# EAGLE design RFID_Eval_13.56MHz (EAGLE 7.5.0)
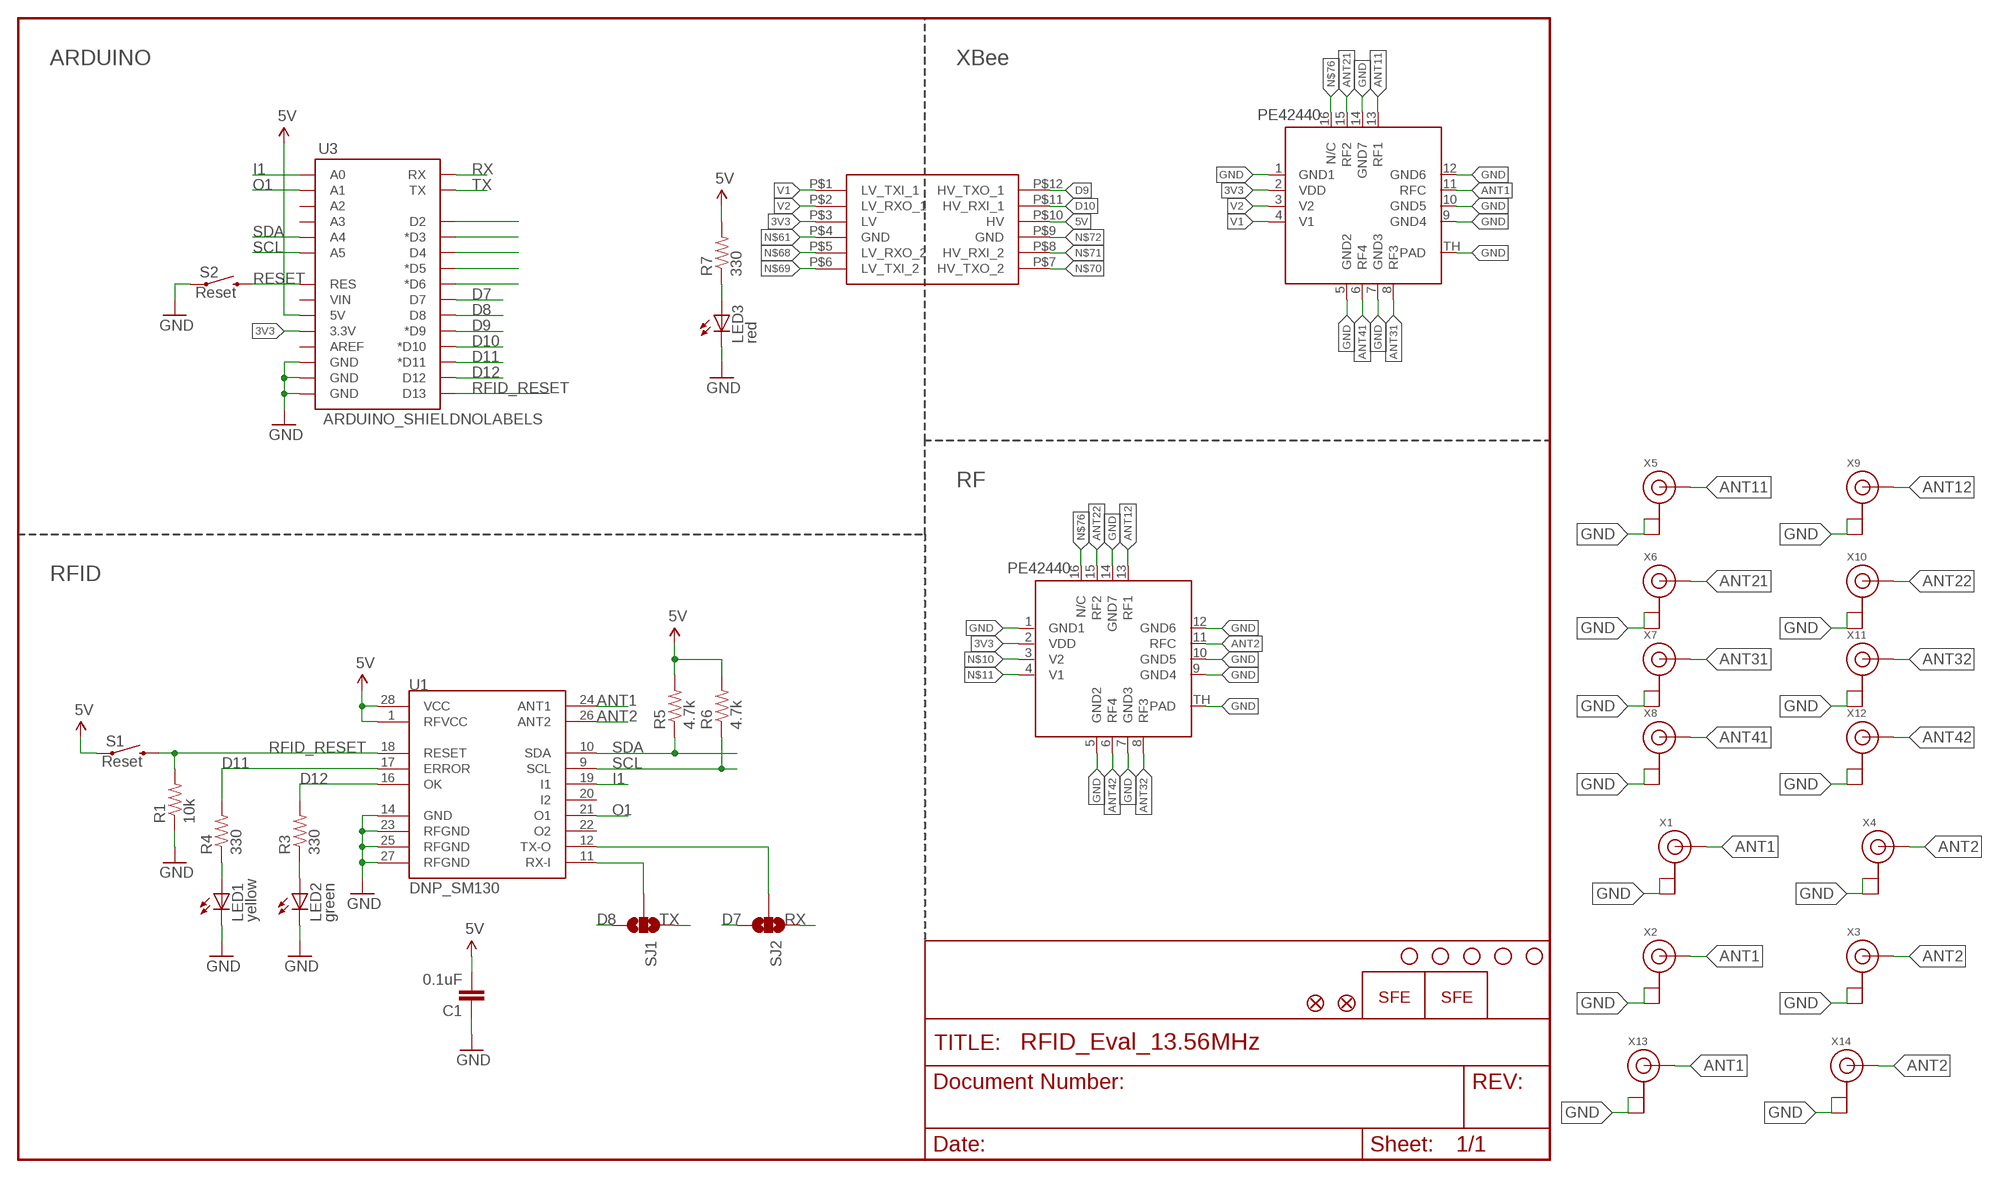
[diagram p0: schematic, sheet 1]

## Parts
C1  0.1uF  CAP0402-CAP  [0402-CAP]
JP2  LOGO-SFENEW  [SFE-NEW-WEBLOGO]
JP3  STAND-OFF  [STAND-OFF]
JP4  LOGO-SFESK  [SFE-LOGO-FLAME]
JP5  STAND-OFF  [STAND-OFF]
JP7  STAND-OFF  [STAND-OFF]
JP10  STAND-OFF  [STAND-OFF]
JP11  FIDUCIAL1X2  [FIDUCIAL-1X2]
JP12  FIDUCIAL1X2  [FIDUCIAL-1X2]
JP13  STAND-OFF  [STAND-OFF]
LED1  yellow  LED0603  [LED-0603]
LED2  green  LED0603  [LED-0603]
LED3  red  LED0603  [LED-0603]
R1  10k  RESISTOR0402-RES  [0402-RES]
R3  330  RESISTOR0402-RES  [0402-RES]
R4  330  RESISTOR0402-RES  [0402-RES]
R5  4.7k  RESISTOR0402-RES  [0402-RES]
R6  4.7k  RESISTOR0402-RES  [0402-RES]
R7  330  RESISTOR0402-RES  [0402-RES]
S1  Reset  SWITCH-MOMENTARY-2SMD  [TACTILE_SWITCH_SMD]
S2  Reset  SWITCH-MOMENTARY-2SMD  [TACTILE_SWITCH_SMD]
SJ1  SOLDERJUMPER_2WAYPASTE2&3  [SJ_3_PASTE2&3]
SJ2  SOLDERJUMPER_2WAYPASTE2&3  [SJ_3_PASTE2&3]
U1  DNP_SM130  SM130  [SM130]
U3  ARDUINO_SHIELDNOLABELS  [DUEMILANOVE_SHIELD_NOLABELS]
U$2  LOGIC_LEVEL_CONVERTER  [LOGIC_LEVEL_CONVERTER]
U$8  PE42440  [PQFP-N16]
U$9  PE42440  [PQFP-N16]
X1  ANTENNA_U.FL  [U.FL]
X2  ANTENNA_U.FL  [U.FL]
X3  ANTENNA_U.FL  [U.FL]
X4  ANTENNA_U.FL  [U.FL]
X5  ANTENNA_U.FL  [U.FL]
X6  ANTENNA_U.FL  [U.FL]
X7  ANTENNA_U.FL  [U.FL]
X8  ANTENNA_U.FL  [U.FL]
X9  ANTENNA_U.FL  [U.FL]
X10  ANTENNA_U.FL  [U.FL]
X11  ANTENNA_U.FL  [U.FL]
X12  ANTENNA_U.FL  [U.FL]
X13  ANTENNA_U.FL  [U.FL]
X14  ANTENNA_U.FL  [U.FL]

## Nets
3V3: U3.3.3V U$2.P$3(LV) U$8.2(VDD) U$9.2(VDD)
5V: C1.2 R5.2 R6.2 R7.2 S1.1 U1.1(RFVCC) U1.28(VCC) U3.5V U$2.P$10(HV)
ANT1: U1.24(ANT1) U$9.11(RFC) X1.3(SIGNAL) X2.3(SIGNAL) X13.3(SIGNAL)
ANT2: U1.26(ANT2) U$8.11(RFC) X3.3(SIGNAL) X4.3(SIGNAL) X14.3(SIGNAL)
ANT11: U$9.13(RF1) X5.3(SIGNAL)
ANT12: U$8.13(RF1) X9.3(SIGNAL)
ANT21: U$9.15(RF2) X6.3(SIGNAL)
ANT22: U$8.15(RF2) X10.3(SIGNAL)
ANT31: U$9.8(RF3) X7.3(SIGNAL)
ANT32: U$8.8(RF3) X11.3(SIGNAL)
ANT41: U$9.6(RF4) X8.3(SIGNAL)
ANT42: U$8.6(RF4) X12.3(SIGNAL)
D7: SJ2.3 U3.D7
D8: SJ1.3 U3.D8
D9: U3.D9(*D9) U$2.P$12(HV_TXO_1)
D10: U3.D10(*D10) U$2.P$11(HV_RXI_1)
D11: R4.2 U1.17(ERROR) U3.D11(*D11)
D12: R3.2 U1.16(OK) U3.D12
GND: C1.1 LED1.C LED2.C LED3.C R1.1 S2.1 U1.14(GND) U1.23(RFGND) U1.25(RFGND) U1.27(RFGND) U3.GND@0(GND) U3.GND@1(GND) U3.GND@2(GND) U$8.1(GND1) U$8.5(GND2) U$8.7(GND3) U$8.9(GND4) U$8.10(GND5) U$8.12(GND6) U$8.14(GND7) U$8.TH(PAD) U$9.1(GND1) U$9.5(GND2) U$9.7(GND3) U$9.9(GND4) U$9.10(GND5) U$9.12(GND6) U$9.14(GND7) U$9.TH(PAD) X1.1(GND) X1.2(GND) X2.1(GND) X2.2(GND) X3.1(GND) X3.2(GND) X4.1(GND) X4.2(GND) X5.1(GND) X5.2(GND) X6.1(GND) X6.2(GND) X7.1(GND) X7.2(GND) X8.1(GND) X8.2(GND) X9.1(GND) X9.2(GND) X10.1(GND) X10.2(GND) X11.1(GND) X11.2(GND) X12.1(GND) X12.2(GND) X13.1(GND) X13.2(GND) X14.1(GND) X14.2(GND)
I1: U1.19(I1) U3.A0
N$1: LED1.A R4.1
N$2: LED2.A R3.1
N$7: LED3.A R7.1
N$10: U$8.3(V2)
N$11: U$8.4(V1)
N$15: SJ2.2 U1.12(TX-O)
N$16: SJ1.2 U1.11(RX-I)
N$61: U$2.P$4(GND)
N$62: U3.D2
N$63: U3.D3(*D3)
N$64: U3.D4
N$65: U3.D5(*D5)
N$66: U3.D6(*D6)
N$68: U$2.P$5(LV_RXO_2)
N$69: U$2.P$6(LV_TXI_2)
N$70: U$2.P$7(HV_TXO_2)
N$71: U$2.P$8(HV_RXI_2)
N$72: U$2.P$9(GND)
N$76: U$8.16(N/C) U$9.16(N/C)
O1: U1.21(O1) U3.A1
RESET: S2.3 U3.RES
RFID_RESET: R1.2 S1.3 U1.18(RESET) U3.D13
RX: SJ2.1 U3.RX
SCL: R6.1 U1.9(SCL) U3.A5
SDA: R5.1 U1.10(SDA) U3.A4
TX: SJ1.1 U3.TX
V1: U$2.P$1(LV_TXI_1) U$9.4(V1)
V2: U$2.P$2(LV_RXO_1) U$9.3(V2)
Unconnected: U1.20(I2) U1.22(O2) U3.A2 U3.A3 U3.AREF U3.VIN

## Notes on the sheet
- ARDUINO | XBee
- RF
- RFID

## Library data of the parts
C1 = SparkFun:CAP: Capacitor Standard 0603 ceramic capacitor, and 0.1" leaded capacitor.
JP2 JP4 = SparkFun:LOGO-SFE: Spark Fun Electronics PCB Logo This is the standard Spark Fun Electronics PCB logo.
JP3 JP5 JP7 JP10 JP13 = SparkFun:STAND-OFF: Stand Off This is the mechanical footprint for a #4 phillips button head screw. Use the keepout ring to avoid running the screw head into surrounding components. SKU : PRT-00447
JP11 JP12 = SparkFun:FIDUCIAL: Fiducial Alignment Points Various fiducial points for machine vision alignment.
LED1-LED3 = SparkFun:LED: LEDs Standard schematic elements and footprints for 5mm, 3mm, 1206, and 0603 sized LEDs. 5mm - Spark Fun Electronics SKU : COM-00529 (and others)
R1 R3-R7 = SparkFun:RESISTOR: Resistor Basic schematic elements and footprints for 0603, 1206, and PTH resistors.
S1 S2 = SparkFun:SWITCH-MOMENTARY-2
SJ1 SJ2 = SparkFun:SOLDERJUMPER_2WAY: Solder Jumper 2 way solder jumper
U1 = SparkFun:SM130: 13.56MHz RFID Mifare Read/Write Module
U3 = SparkFun:ARDUINO_SHIELD
U$2 = SparkFun-Boards:LOGIC_LEVEL_CONVERTER: Logic Level Converter (3.3v - 5v) https://www.sparkfun.com/products/8745
U$8 U$9 = texas:PE42440: PE42440 SP4T RF Switch
X1-X14 = adafruit:ANTENNA_U.FL: U.FL Antenna Connector

## Board
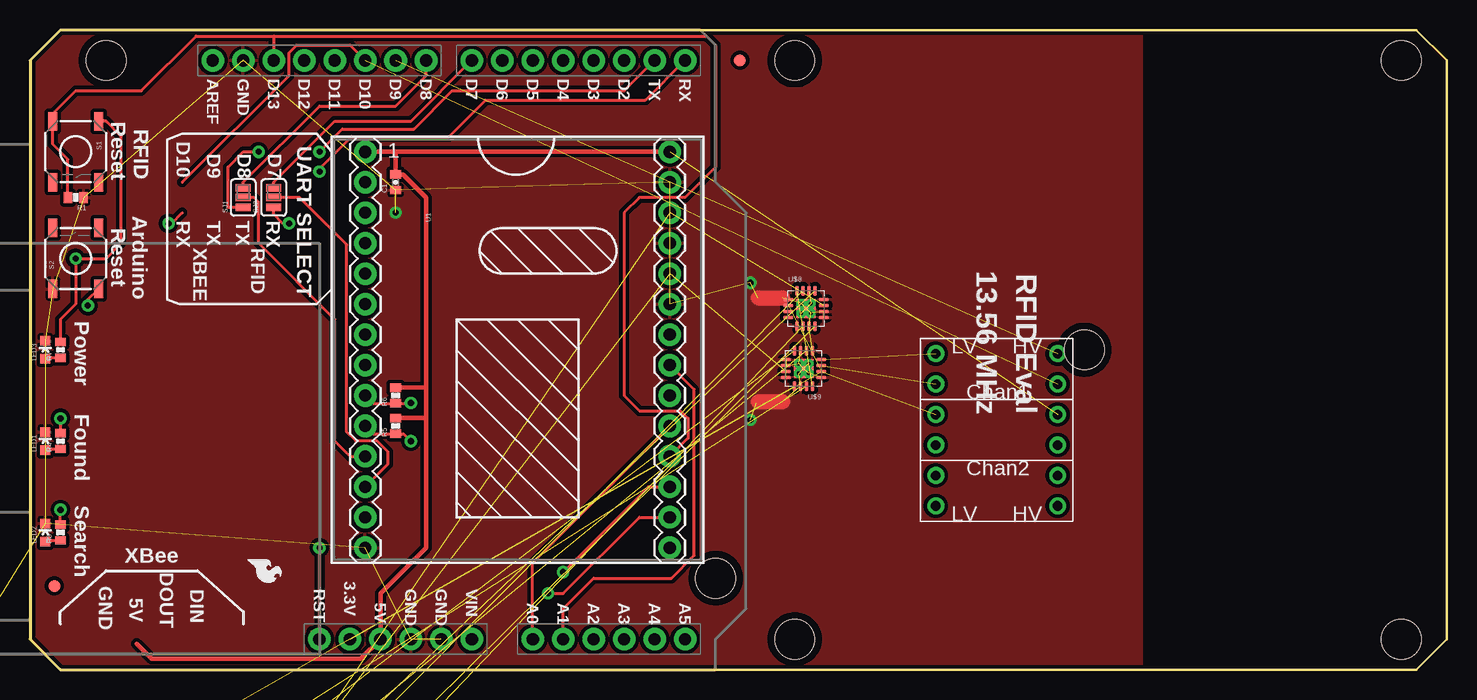
[diagram p1: board, top side]
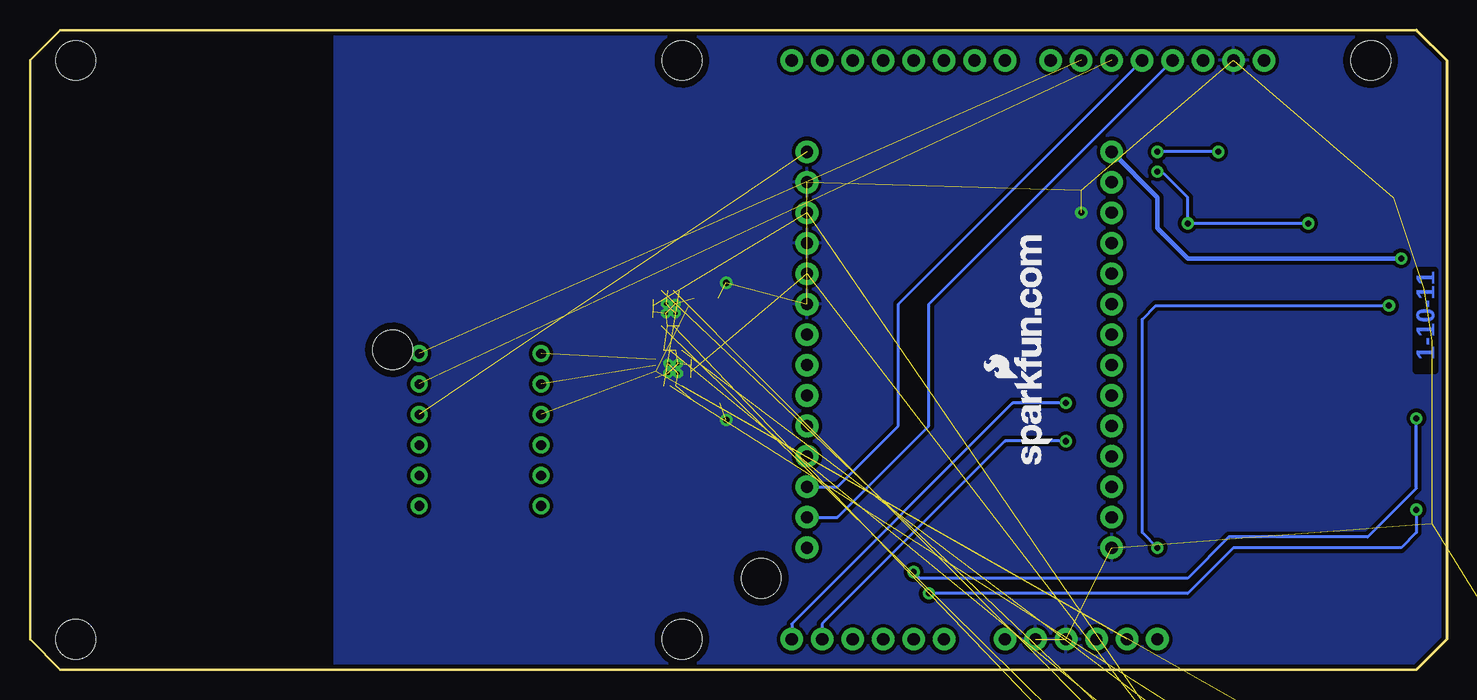
[diagram p2: board, bottom side, seen from below]

Size 118.11 x 53.34 mm. Coordinates in mm from the lower left corner, seen from the top.
Outline: 0,50.8 0,2.54 2.54,0 115.57,0 118.11,2.54 118.11,50.8 115.57,53.34 2.54,53.34 0,50.8
Copper layers (1*16): Top 0.035mm / dielectric 1.5mm / Bottom 0.035mm
Design rules "SparkFun": minimum track width 8mil, minimum drill 20mil, track to track 8mil, track to pad 8mil, pad to pad 8mil, via to via 8mil, smd to smd 8mil, copper to edge 8mil, drill to drill 8mil, minimum pad ring 12mil, minimum via ring 10mil, stop-mask expansion 4mil, vias tented up to drill 20mil, thermal gap 10mil

### Footprints (pad centres in the part's own frame; a part is rotated, then mirrored left to right if it is on the bottom)
0402-CAP = smd 0.7 x 0.9: 1 -0.65,0; 2 0.65,0
STAND-OFF = hole 3.302: 0,0
FIDUCIAL-1X2 = smd 1 x 1: 1 0,0
LED-0603 = smd 0.8 x 0.8: A 0,-0.75; C 0,0.75
0402-RES = smd 0.7 x 0.9: 1 -0.65,0; 2 0.65,0
TACTILE_SWITCH_SMD = smd 1.524 x 0.762: 1 -2.54,1.905; 2 2.54,1.905; 3 -2.54,-1.905; 4 2.54,-1.905
SJ_3_PASTE2&3 = smd 0.635 x 1.27: 1 -0.813,0; 2 0,0; 3 0.813,0
SM130 = drill 1.016 pad 1.88: 1 -17.78,-12.7; 2 -15.24,-12.7; 3 -12.7,-12.7; 4 -10.16,-12.7; 5 -7.62,-12.7; 6 -5.08,-12.7; 7 -2.54,-12.7; 8 0,-12.7; 9 2.54,-12.7; 10 5.08,-12.7; 11 7.62,-12.7; 12 10.16,-12.7; 13 12.7,-12.7; 14 15.24,-12.7; 15 15.24,12.7; 16 12.7,12.7; 17 10.16,12.7; 18 7.62,12.7; 19 5.08,12.7; 20 2.54,12.7; 21 0,12.7; 22 -2.54,12.7; 23 -5.08,12.7; 24 -7.62,12.7; 25 -10.16,12.7; 26 -12.7,12.7; 27 -15.24,12.7; 28 -17.78,12.7
DUEMILANOVE_SHIELD_NOLABELS = drill 1.016 pad 1.88: 3.3V 50.8,26.67; 5V 50.8,29.21; A0 50.8,41.91; A1 50.8,44.45; A2 50.8,46.99; A3 50.8,49.53; A4 50.8,52.07; A5 50.8,54.61; AREF 2.54,15.24; D2 2.54,49.53; D3 2.54,46.99; D4 2.54,44.45; D5 2.54,41.91; D6 2.54,39.37; D7 2.54,36.83; D8 2.54,33.02; D9 2.54,30.48; D10 2.54,27.94; D11 2.54,25.4; D12 2.54,22.86; D13 2.54,20.32; GND@0 50.8,31.75; GND@1 50.8,34.29; GND@2 2.54,17.78; RES 50.8,24.13; RX 2.54,54.61; TX 2.54,52.07; VIN 50.8,36.83 | hole 3.302: 45.72,57.15; 2.54,6.35
LOGIC_LEVEL_CONVERTER = drill 0.8: P$1 1.27,13.97; P$2 1.27,11.43; P$3 1.27,8.89; P$4 1.27,6.35; P$5 1.27,3.81; P$6 1.27,1.27; P$7 11.43,1.27; P$8 11.43,3.81; P$9 11.43,6.35; P$10 11.43,8.89; P$11 11.43,11.43; P$12 11.43,13.97
PQFP-N16 = smd 0.85 x 0.3: 1 0.07,2.3; 2 0.07,1.8; 3 0.07,1.3; 4 0.07,0.8; 9 3.02,0.8; 10 3.02,1.3; 11 3.02,1.8; 12 3.02,2.3 | smd 0.3 x 0.85: 5 0.795,0.075; 6 1.295,0.075; 7 1.795,0.075; 8 2.295,0.075; 13 2.295,3.025; 14 1.795,3.025; 15 1.295,3.025; 16 0.795,3.025 | smd 1.6 x 1.6: TH 1.545,1.55
U.FL = smd 2.2 x 1.05: 1 0,1.375; 2 0,-1.375 | smd 0.8 x 1: 3 1.525,0

### Placement (x,y rotation side)
C1  30.48,40.64 90 top
JP2  32.89,17.14 90 bottom
JP3  87.88,26.67 0 top
JP4  18.16,9.14 270 top
JP5  114.3,50.8 0 top
JP7  114.3,2.54 0 top
JP10  63.75,50.8 0 top
JP11  2.03,6.99 0 top
JP12  59.18,50.8 0 top
JP13  63.75,2.54 0 top
LED1  1.27,19.05 0 top
LED2  1.27,11.43 0 top
LED3  1.27,26.67 0 top
R1  3.81,39.37 180 top
R3  2.54,11.43 90 top
R4  2.54,19.05 90 top
R5  30.48,20.32 90 top
R6  30.48,22.86 90 top
R7  2.54,26.67 90 top
S1  3.81,43.18 270 top
S2  3.81,34.29 90 top
SJ1  17.78,39.37 90 top
SJ2  20.32,39.37 90 top
U1  40.64,25.4 270 top
U3  0,53.34 270 top
U$2  74.24,12.38 0 top
U$8  63.15,28.57 0 top
U$9  66.04,26.67 180 top
X1  -19.54,-59.86 0 top  (outside the outline)
X2  -19.54,-72.21 0 top  (outside the outline)
X3  -19.54,-78.38 0 top  (outside the outline)
X4  -19.54,-66.03 0 top  (outside the outline)
X5  -19.54,-22.81 0 top  (outside the outline)
X6  -19.54,-28.99 0 top  (outside the outline)
X7  -19.54,-35.16 0 top  (outside the outline)
X8  -19.54,-41.33 0 top  (outside the outline)
X9  -19.54,-47.51 0 top  (outside the outline)
X10  -15.74,-47.51 0 top  (outside the outline)
X11  -19.54,-53.68 0 top  (outside the outline)
X12  -15.74,-53.68 0 top  (outside the outline)
X13  -19.54,-84.55 0 top  (outside the outline)
X14  -19.54,-90.73 0 top  (outside the outline)

### Tracks (layer width: path | path; a pad name or v marks a point on that pad's centre or on a via)
3V3  (3 unrouted)
5V  (via drill 0.51)  (1 unrouted)
  Top 0.254: S1.1 6.35,45.72 7.62,44.45 7.62,35.56 6.35,34.29 v3.81,34.29 3.81,30.48 2.54,29.21 R7.2
  Top 0.356: 8.89,2.16 10.16,0.89 27.56,0.89 U3.5V 29.21,6.35 33.02,10.16 33.02,20.95 | 30.48,43.18 U1.1 | 30.48,43.18 U1.28 | 30.48,43.18 C1.2 31.1,41.29 33.02,39.37 33.02,23.5 | 33.02,20.95 33.02,23.5 | R5.2 33.01,20.97 33.02,20.95 | R6.2 33.01,23.51 33.02,23.5
  Bottom 0.381: v3.81,34.29 21.59,34.29 24.13,36.83 24.13,39.37 U1.1
ANT1  (4 unrouted)
ANT2  (4 unrouted)
ANT11  (1 unrouted)
ANT12  (1 unrouted)
ANT21  (1 unrouted)
ANT22  (1 unrouted)
ANT31  (1 unrouted)
ANT32  (1 unrouted)
ANT41  (1 unrouted)
ANT42  (1 unrouted)
D7
  Top 0.254: SJ2.3 20.32,40.64 25.4,45.72 31.75,45.72 U3.D7
D8
  Top 0.254: U3.D8 33.02,49.53 30.48,46.99 24.13,46.99 17.78,40.64 SJ1.3
D9  (1 unrouted)
D10  (1 unrouted)
  Top 0.254: 12.7,40.64 21.59,49.53 21.59,51.44 22.23,52.07 26.67,52.07 U3.D10
D11  (via drill 0.51)
  Top 0.254: v2.54,20.95 R4.2 | U1.17 51.56,15.24 v44.45,8.13
  Bottom 0.254: U3.D11 45.72,30.48 45.72,20.32 50.8,15.24 U1.17 | v2.54,20.95 2.54,15.11 6.6,11.05 18.16,11.05 21.59,7.62 43.94,7.62 v44.45,8.13
D12  (via drill 0.51)
  Top 0.254: R3.2 v2.54,13.34 | v43.18,6.35 44.45,6.35 50.8,12.7 U1.16
  Bottom 0.254: U3.D12 43.18,30.48 43.18,20.32 50.8,12.7 U1.16 | v2.54,13.34 2.54,11.43 3.81,10.16 17.78,10.16 21.59,6.35 v43.18,6.35
GND  (via drill 0.3 pad 0.12, 0.51)  (69 unrouted)
  Top 0.813: 60.71,22.35 60.58,22.23
  Top 1.27: 60.71,22.35 62.74,22.35 | 60.71,30.99 62.74,30.99
  other vias: 60.07,32.26 60.07,20.83 30.48,38.1 64.1,25.52 64.91,25.52 64.91,24.73 64.1,24.71 64.3,30.51 65.09,30.51 65.09,29.73 64.29,29.72
  pour Bottom (isolate 0.305): 0,53.34 92.71,53.34 92.71,0 0,0
  pour Top (isolate 0.305): 0,53.34 92.71,53.34 92.71,0 0,0
I1
  Top 0.254: U3.A0 41.91,8.89 U1.19
N$1
  Top 0.254: R4.1 1.37,18.4 LED1.A
N$2
  Top 0.254: R3.1 1.37,10.78 LED2.A
N$7
  Top 0.254: R7.1 1.37,26.02 LED3.A
N$15
  Top 0.254: SJ2.2 22.48,39.37 26.42,35.43 26.42,19.81 27.18,19.05 28.96,19.05 29.84,18.16 29.84,17.14 U1.12
N$16
  Top 0.254: SJ1.2 18.67,39.37 19.05,38.99 19.05,35.56 25.4,29.21 25.4,19.05 26.67,17.78 U1.11
N$76  (1 unrouted)
O1
  Top 0.254: U3.A1 44.45,5.08 46.99,7.62 53.47,7.62 55.37,9.53 55.37,23.37 U1.21
RESET  (via drill 0.51)
  Top 0.254: 23.48,3.19 U3.RES v24.13,10.16 | v4.83,30.35 4.83,30.86 S2.3
  Bottom 0.254: v24.13,10.16 25.4,11.43 25.4,29.21 24.26,30.35 v4.83,30.35
RFID_RESET
  Top 0.254: R1.2 3.16,42.56 1.91,43.81 S1.3 1.91,46.35 3.81,48.26 9.27,48.26 13.84,52.83 20.32,52.83 | 20.32,52.83 56.39,52.83 57.15,52.07 57.15,41.91 54.61,39.37 50.8,39.37 49.53,38.1 49.53,22.86 50.8,21.59 54.23,21.59 54.86,20.95 54.86,19.3 U1.18 | 20.32,52.83 U3.D13
RX  (via drill 0.51)
  Top 0.254: v11.56,37.21 11.81,37.21 12.7,38.1 | SJ2.1 20.32,37.97 21.08,37.21 v21.59,37.21 | v24.13,41.53 24.13,41.78 26.8,44.45 34.92,44.45 37.97,47.5 51.31,47.5 U3.RX
  Bottom 0.254: v11.56,37.21 v21.59,37.21 21.59,39.37 23.75,41.53 v24.13,41.53
SCL  (via drill 0.51)
  Top 0.254: U1.9 28.59,22.21 R6.1 31.73,22.21 v31.75,22.23
  Bottom 0.254: v31.75,22.23 36.2,22.23 54.61,3.81 U3.A5
SDA  (via drill 0.51)
  Top 0.254: U1.10 28.59,19.67 R5.1 31.13,19.67 v31.75,19.05
  Bottom 0.254: U3.A4 52.07,3.81 36.83,19.05 v31.75,19.05
TX  (via drill 0.51)
  Top 0.254: SJ1.1 16.51,38.56 16.51,41.91 17.78,43.18 v19.05,43.18 | U3.TX 49.53,48.26 35.18,48.26 32,45.09 26.04,45.09 v24.13,43.18
  Bottom 0.254: v19.05,43.18 v24.13,43.18
V1  (1 unrouted)
V2  (1 unrouted)

### Text on the board
Bottom: 1-10-11
tPlace: AREF | GND | D13 | D12 | D11 | D10 | D9 | D8 | D7 | D6 | D5 | D4 | D3 | D2 | TX | RX | Reset | RFID | D10 | UART SELECT | D9 | D8 | D7 | Arduino | Reset | RX | TX | TX | RX | XBEE | RFID | 13.56 MHz | RFID Eval | Power | Found | Search | XBee | DOUT | GND | DIN | RST | 3.3V | GND | GND | VIN | 5V | 5V | A0 | A1 | A2 | A3 | A4 | A5